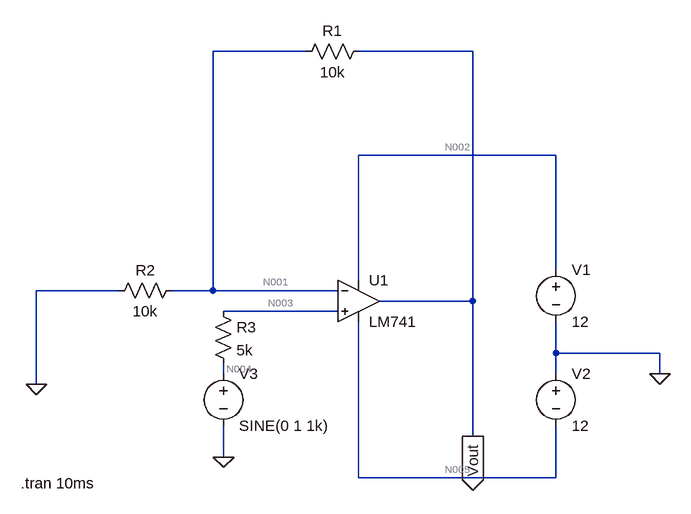
[diagram p0: schematic Complete.asc]
Complete.asc, the LTspice schematic file:
Version 4
SHEET 1 1664 680
WIRE 144 -400 0 -400
WIRE 400 -400 224 -400
WIRE 528 -240 224 -240
WIRE 528 -64 528 -240
WIRE 224 -48 224 -240
WIRE -144 -32 -272 -32
WIRE 0 -32 0 -400
WIRE 0 -32 -64 -32
WIRE 192 -32 0 -32
WIRE 400 -16 400 -400
WIRE 400 -16 256 -16
WIRE 192 0 16 0
WIRE 528 64 528 16
WIRE 688 64 528 64
WIRE 16 96 16 80
WIRE 528 96 528 64
WIRE 688 96 688 64
WIRE -272 112 -272 -32
WIRE 400 192 400 -16
WIRE 16 224 16 176
WIRE 224 256 224 16
WIRE 528 256 528 176
WIRE 528 256 224 256
FLAG 688 96 0
FLAG 16 224 0
FLAG -272 112 0
FLAG 400 192 Vout
IOPIN 400 192 Out
SYMBOL LM741 224 -80 R0
SYMATTR InstName U1
SYMBOL voltage 528 -80 R0
WINDOW 123 0 0 Left 0
WINDOW 39 0 0 Left 0
SYMATTR InstName V1
SYMATTR Value 12
SYMBOL voltage 528 80 R0
WINDOW 123 0 0 Left 0
WINDOW 39 0 0 Left 0
SYMATTR InstName V2
SYMATTR Value 12
SYMBOL res 240 -416 R90
WINDOW 0 0 56 VBottom 2
WINDOW 3 32 56 VTop 2
SYMATTR InstName R1
SYMATTR Value 10k
SYMBOL voltage 16 80 R0
WINDOW 123 0 0 Left 0
WINDOW 39 0 0 Left 0
SYMATTR InstName V3
SYMATTR Value SINE(0 1 1k)
SYMBOL res -48 -48 R90
WINDOW 0 0 56 VBottom 2
WINDOW 3 32 56 VTop 2
SYMATTR InstName R2
SYMATTR Value 10k
SYMBOL res 0 -16 R0
SYMATTR InstName R3
SYMATTR Value 5k
TEXT -296 264 Left 2 !.tran 10ms

The netlist it stands for:
* Complete.asc
XU1 N003 N001 N002 N005 Vout LM741  ; pins In+ In- V+ V- OUT
V1 N002 0 12
V2 0 N005 12
R1 Vout N001 10k
V3 N004 0 SINE(0 1 1k)
R2 N001 0 10k
R3 N003 N004 5k
.tran 10ms
.lib LM741.lib
.backanno
.end

* Results of the author's LTspice run, read from the files saved beside the schematic
* Operating Point, zero values left out:
*   V(n001) = 710.7 µV
*   V(n003) = -289.3 µV
*   V(n005) = -12 V
*   V(n002) = 12 V
*   V(vout) = 2.44 mV
*   I(R3) = -57.86 nA
*   I(R2) = 71.07 nA
*   I(R1) = 172.9 nA
*   I(V3) = -57.86 nA
*   I(V2) = -1.626 mA
*   I(V1) = -1.626 mA
*   Ix(u1:1) = 57.86 nA
*   Ix(u1:2) = 101.9 nA
*   Ix(u1:99) = 1.626 mA
*   Ix(u1:50) = -1.626 mA
*   Ix(u1:28) = -172.9 nA
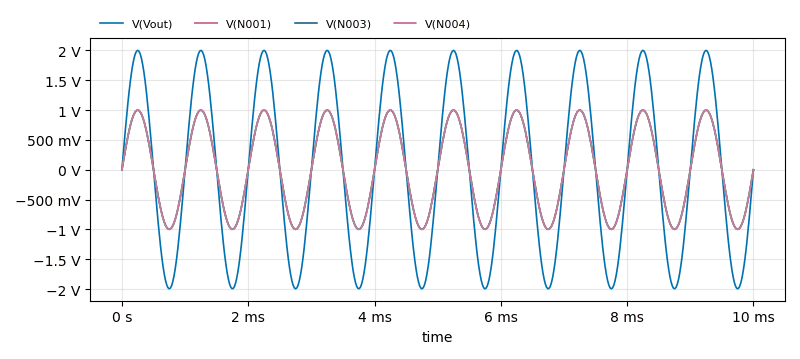
[diagram p1: Transient Analysis of Complete.asc, plotted from the saved traces]
* Transient Analysis, 1 run:
*   V(Vout): min -1.996 V, max 2.001 V, average 2.439 mV, rms 1.413 V, last -1.524 mV
*   V(N001): min -998.4 mV, max 999.8 mV, average 710 µV, rms 706.5 mV, last -1.237 mV
*   V(N003): min -999.3 mV, max 998.8 mV, average -290.1 µV, rms 706.5 mV, last -324 µV
*   V(N004): min -1 V, max 1 V, average -801.5 nV, rms 707.2 mV, last 0 V